# Altium project Doorbellv1.PrjPcb
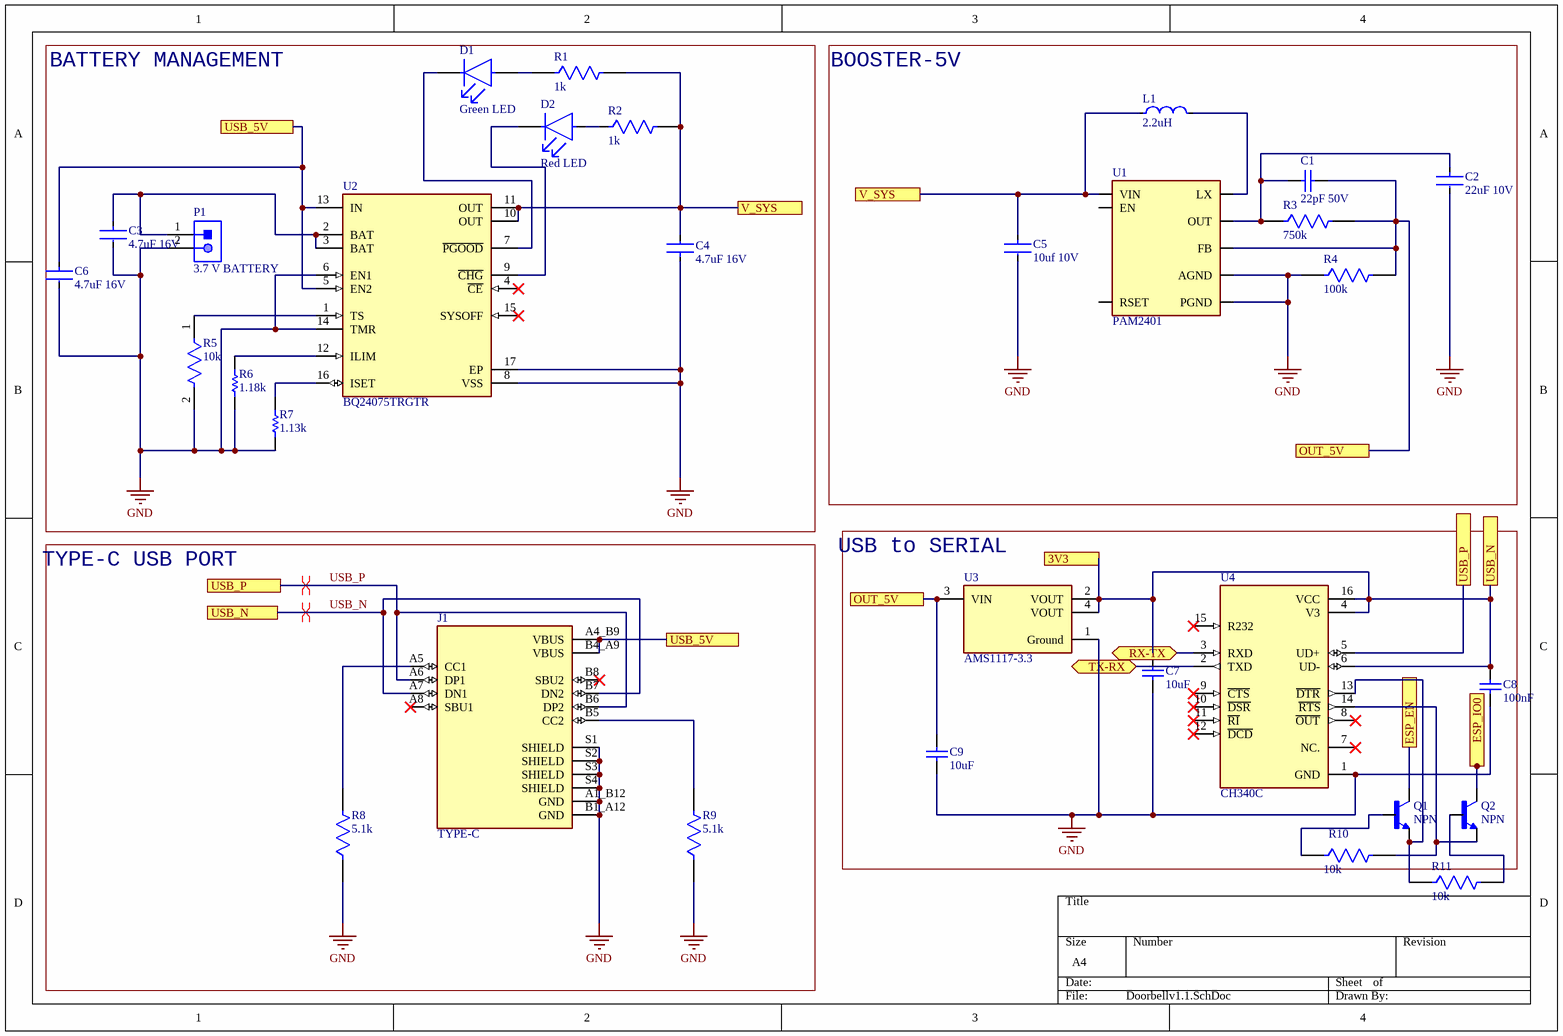
[diagram p0: Doorbellv1.1.SchDoc]
3 sheets, 49 parts. Net scope: flat (ports and power ports of the same name join across sheets).
Board file: MainBoard.PcbDoc
Sheets:
  Doorbellv1.1.SchDoc
  Doorbellv1.2.SchDoc
  Doorbellv1.3.SchDoc

## Sheet Doorbellv1.1.SchDoc
size A4; SheetNumber: 1; SheetTotal: 3

### Parts
C1  22pF 50V  [CAPC0805(2012)145_N]
C2  22uF 10V  [FP-C0805C226M8PACTU-MFG]
C3  4.7uF 16V  [FP-GRM21B-0_15-MFG]
C4  4.7uF 16V  [FP-GRM21B-0_15-MFG]
C5  10uf 10V  [FP-C0805X106K8RACAUTO-MFG]
C6  4.7uF 16V  [FP-GRM21B-0_15-MFG]
C7  10uF  [CAPC2013X140X50ML20T25]
C8  100nF  [CAPC1608X90X35NL15T15]
C9  10uF  [CAPC2013X140X50ML20T25]
D1  Green LED  [FP-APHCM2012CGCK-F01-MFG]
D2  Red LED  [FP-LS_R976-MFG]
J1  TYPE-C  [HRO_TYPE-C-31-M-12]
L1  2.2uH  [FP-NR4018-MFG]
P1  3.7 V BATTERY  [JST-S2B-PH-K-S_V]
Q1  NPN  [TRANS_SS8050-G]
Q2  NPN  [TRANS_SS8050-G]
R1  1k  [FP-TFCR0805-IPC_A]
R2  1k  [FP-TFCR0805-IPC_A]
R3  750k  [FP-AC0805-MFG]
R4  100k  [FP-CRCW0805-e3-IPC_A]
R5  10k  [FP-RN732B-MFG]
R6  1.18k  [RESC2013X60X35LL10T20]
R7  1.13k  [RESC0805(2012)_L]
R8  5.1k  [FP-CRCW0603-C-MFG]
R9  5.1k  [FP-CRCW0603-C-MFG]
R10  10k  [FP-CPF0603-MFG]
R11  10k  [FP-CPF0603-MFG]
U1  PAM2401  [MSOP8]
U2  BQ24075TRGTR  [FP-RGT0016C-IPC_C]
U3  AMS1117-3.3  [FP-AMS1117-IPC_C]
U4  CH340C  [SOIC127P600X180-16N]

### Blocks framed on the sheet
BATTERY MANAGEMENT: C3 C4 C6 D1 D2 P1 R1 R2 R5-R7 U2
BOOSTER-5V: C1 C2 C5 L1 R3 R4 U1
TYPE-C USB PORT: J1 R8 R9
USB to SERIAL: C7-C9 Q1 Q2 R10 U3 U4

### Ports
3V3 (see Doorbellv1.2[2A], Doorbellv1.3[1A]), ESP_EN (see Doorbellv1.2[1B]), ESP_IO0 (see Doorbellv1.2[1B]), OUT_5V (see Doorbellv1.1[3C], Doorbellv1.2[4B], Doorbellv1.3[1C], Doorbellv1.3[3B], Doorbellv1.3[4A]), OUT_5V (see Doorbellv1.1[4B], Doorbellv1.2[4B], Doorbellv1.3[1C], Doorbellv1.3[3B], Doorbellv1.3[4A]), RX-TX (bidir, see Doorbellv1.2[2B]), TX-RX (bidir, see Doorbellv1.2[2B]), USB_5V (see Doorbellv1.1[1A]), USB_5V (see Doorbellv1.1[2C]), USB_N (see Doorbellv1.1[1C]), USB_N (see Doorbellv1.1[4C]), USB_P (see Doorbellv1.1[1C]), USB_P (see Doorbellv1.1[4C]), V_SYS (see Doorbellv1.1[2A]), V_SYS (see Doorbellv1.1[3A])

### Nets
GND: C2.2 C3.2 C4.1 C5.2 C6.2 C7.1 C8.1 C9.1 J1.A1_B12(GND) J1.B1_A12(GND) J1.S1(SHIELD) J1.S2(SHIELD) J1.S3(SHIELD) J1.S4(SHIELD) P1.2 R4.1 R5.2 R6.1 R7.1 R8.1 R9.1 U1.4(AGND) U1.8(PGND) U2.6(EN1) U2.8(VSS) U2.14(TMR) U2.17(EP) U3.1(Ground) U4.1(GND)
CAM_XCLK: Q2.3(C) ; port ESP_IO0
USB_N: C7.2 C8.2 J1.A7(DN1) J1.B7(DN2) U3.2(VOUT) U3.4(VOUT) U4.4(V3) U4.6(UD-) U4.16(VCC) ; port USB_N, port 3V3
USB_P: J1.A6(DP1) J1.B6(DP2) U4.5(UD+) ; port USB_P
NetC1_1: C1.1 C2.1 R3.1 U1.7(OUT)
NetC1_2: C1.2 C9.2 R3.2 R4.2 U1.5(FB) U3.3(VIN) ; port OUT_5V
NetC3_1: C3.1 P1.1 U2.2(BAT) U2.3(BAT)
NetC4_2: C4.2 C5.1 L1.1 R1.2 R2.2 U1.3(VIN) U2.10(OUT) U2.11(OUT) ; port V_SYS
NetC6_1: C6.1 J1.A4_B9(VBUS) J1.B4_A9(VBUS) U2.5(EN2) U2.13(IN) ; port USB_5V
NetC11_1: Q1.3(C) ; port ESP_EN
NetD1_1: D1.1(C) U2.7(~{PGOOD})
NetD1_2: D1.2(A) R1.1
NetD2_1: D2.1(C) U2.9(~{CHG})
NetD2_2: D2.2(A) R2.1
NetJ1_A5: J1.A5(CC1) R8.2
NetJ1_B5: J1.B5(CC2) R9.2
NetL1_2: L1.2 U1.1(LX)
NetQ1_1: Q1.1(B) R10.1
NetQ1_2: Q1.2(E) R11.1 U4.13(~{DTR})
NetQ2_1: Q2.1(B) R11.2
NetQ2_2: Q2.2(E) R10.2 U4.14(~{RTS})
NetR5_1: R5.1 U2.1(TS)
NetR6_2: R6.2 U2.12(ILIM)
NetR7_2: R7.2 U2.16(ISET)
NetU4_2: U4.2(TXD) ; port TX-RX
NetU4_3: U4.3(RXD) ; port RX-TX

Not connected (* = marked no-connect by the designer): J1 A8(SBU1)* B8(SBU2)*; U1 2(EN) 6(RSET); U2 4(~{CE})* 15(SYSOFF)*; U4 7(NC.)* 8(~{OUT})* 9(~{CTS})* 10(~{DSR})* 11(~{RI})* 12(~{DCD})* 15(R232)*

### Layout directives
differential pair: USB_N, USB_P

### Library data of the parts
C1 = CMP-1036-01235-1: CAP 22pF 50V ±1% 0805 (2012 Metric) Thickness 1.45mm SMD; Tolerance: Â±1%; Case-Metric: 2012; Case-EIA: 0805; Max Thickness: 1.45 mm; Rated Voltage: 50 V; Value: 22pF; Technology: SMT
C2 = CMP-03020-034697-1: CAP CER 22UF 10V X5R 0805; Tolerance: 20%; Dissipation Factor: 10%; Dielectric Material: Ceramic; Termination: Solder; Case Code (Imperial): 0805; Packaging: Tape and Reel; Height: 1.25mm; Voltage: 10V; Case Code (Metric): 2012; Case/Package: 0805; Width: 0.049inch; Capacitance: 22uF; Length: 0.079inch; Depth: 1.25mm; RoHS Compliant: Yes; Voltage Rating (DC): 10V; Lead Free: Lead Free; Dielectric: X5R; Thickness: 0.055inch; Mount: Surface Mount; Voltage Rating: 10V; Max Operating Temperature: 85°C; Min Operating Temperature: -55°C
C3 C4 C6 = CMP-06035-032042-1: Chip Multilayer Ceramic Capacitors for General Purpose, 0805, 4.7uF, X7R, 15%, 20%, 16V; Tolerance: 20%; Capacitance: 4.7uF; Case/Package: 0805; Thickness: 1.25mm; Length: 2mm; Width: 1.25mm; Dielectric: X7R; Voltage Rating (DC): 16V
C5 = CMP-03020-034694-1: Tolerance: 10%; Case/Package: 0805; Min Operating Temperature: -55°C; Max Operating Temperature: 125°C; RoHS Compliant: Yes; Ratings: AEC-Q200; Mount: Surface Mount; Features: Soft Termination; Capacitance: 10uF; Packaging: Cut Tape; Case Code (Metric): 2012; Voltage Rating: 10V; Case Code (Imperial): 0805
C7 C9 = CMP-2007-04644-1: Part Number: 08056D106KAT4A; Manufacturer: AVX Interconnect / Elco
C8 = CMP-2006-04392-1: Manufacturer: AVX Interconnect / Elco; Part Number: 06035C104MAT2A
D1 = CMP-44529-000062-1: LED GREEN CLEAR CHIP SMD; Dominant Wavelength: 570nm; Forward Current: 20mA; Number of LEDs: 1; Luminous Intensity: 40mcd; Forward Voltage: 2.1V; Viewing Angle: 110°; Illumination Color: Green; Lens Style: Clear; Mount: Surface Mount; Length: 2mm; Max Operating Temperature: 85°C; Series: APHCM; Width: 1.25mm; Lead Free: Lead Free; Wavelength: 570nm; Package Quantity: 1; Number of Pins: 2; Case Code (Metric): 2012; RoHS Compliant: Yes; Packaging: Tape and Reel; Lens Color: Clear; Case/Package: 0805; Case Code (Imperial): 0805; Test Current: 20mA; Color: Green; Min Operating Temperature: -40°C; Height: 0.4mm
D2 = CMP-62016-000037-1: LED RED DIFFUSED 0805 SMD; Lens Size: 1.25mm; Number of LEDs: 1; Luminous Intensity: 180mcd; Dominant Wavelength: 633nm; Lens Style: Flat; Reverse Voltage: 12V; Lens Color: White; Forward Voltage: 2.5V; Forward Current: 25mA; Power Dissipation: 65W; Luminous Flux: 0.47lm; Test Current: 20mA; Viewing Angle: 160°; Length: 2mm; Number of Pins: 2; Lens Transparency: Diffused; Min Operating Temperature: -30°C; Case Code (Metric): 2012; Depth: 1.35mm; Color: Red; Illumination Color: Red; Max Operating Temperature: 85°C; Mount: Surface Mount; Case/Package: 0805; Height: 0.9mm; Package Quantity: 16000; Number of Elements: 1; Radiation Hardening: No; Case Code (Imperial): 0805; Packaging: Tape and Reel; Width: 1.25mm
J1 = TYPE-C-31-M-12: USB Connectors 24 Receptacle 1 8.94*7.3mm RoHS; MF: HRO Electronics Co., Ltd.; SnapEDA_Link: https://www.snapeda.com/parts/TYPE-C-31-M-12/HRO+Electronics+Co.%252C+Ltd./view-part/?ref=snap; Package: Package; Value: *; MP: TYPE-C-31-M-12; Check_prices: https://www.snapeda.com/parts/TYPE-C-31-M-12/HRO+Electronics+Co.%252C+Ltd./view-part/?ref=eda
L1 = CMP-14484-000071-2: SMD Power Inductors 2.2uH ±20% 2.2A 50.4mΩ; Test Frequency: 100kHz; Shielding: Shielded; Core Material: Ferrite; Saturation Current: 3A; Self Resonant Frequency: 60MHz; DC Resistance (DCR): 50.4mR; Height - Seated (Max): 0.071inch; RMS Current (Irms): 2.2A; Min Operating Temperature: -25°C; RoHS Compliant: Yes; Max Operating Temperature: 125°C; Package Quantity: 3500; Halogen Free: Halogen Free; Number of Pins: 2; Packaging: Tape and Reel; Inductance Tolerance: 20%; Lead Pitch: 2.8mm; Width: 0.157inch; Max DC Current: 3A; Tolerance: 20%; Length: 4mm; Resistor Type: Wirewound; Depth: 4.2mm; Current Rating: 2.2A; Lead Free: Lead Free; Series: NRS; Termination: SMD/SMT; Radiation Hardening: No; Mount: Surface Mount; Height: 1.8mm; Inductance: 2.2uH; Case/Package: Nonstandard
P1 = CMP-1755-00004-1: Male Header, Pitch 2 mm, 1 x 2 Position, Height 4.8 mm, Tail Length 3.4 mm, -25 to 85 degC, RoHS, Bulk; Case\Package: Radial; Tolerance: 20%; Capacitance: 10 uF; Voltage Rating (DC): 50 V; Packaging: Bulk; ComponentLink1URL: http://www.jst-mfg.com/product/pdf/eng/ePH.pdf; Radiation Hardening: No; Height: 11 mm; Package Quantity: 200; PackageDescription: Male Header, Pitch 2 mm, 1 x 2 Position, Height 4.8 mm, Tail Length 3.4 mm; PackageReference: S2B-PH-K-S; Diameter: 5 mm; Pins: 2; Mount: Through Hole; Max Operating Temperature: 85 degC; Min Operating Temperature: -40 degC; ComponentLink1Description: Datasheet; DatasheetVersion: Dec-12; Length: 11 mm; Lead Pitch: 2 mm; REACH SVHC: No SVHC; Voltage Rating: 50 V; RoHSCompliant: true
Q1 Q2 = SS8050-G: Bipolar (BJT) Transistor NPN 25 V 1.5 A 100MHz 300 mW Surface Mount SOT-23-3; MP: SS8050G; MF: Comchip; Digi-Key_Part_Number: 641-1790-2-ND; Check_prices: https://www.snapeda.com/parts/SS8050G/Comchip/view-part/?ref=eda; Package: None; SnapEDA_Link: https://www.snapeda.com/parts/SS8050G/Comchip/view-part/?ref=snap; Value: *
R1 R2 = CMP-250906-148809-1: RES Thin Film,  1kΩ, 0.1%, 0.1W, 25ppm/°C, 0805
R3 = CMP-03412-037118-1: AC Series 0805 750 kO ±1% 0.125 W ±100 ppm/°C SMT Thick Film Chip Resistor; Manufacturer: Yageo; Manufacturer Part Number: AC0805FR-07750KL; Resistance: 750KΩ; Power Rating: 1/8W; Automotive Grade: Grade 0; Value: 750KΩ; Tolerance: 0.01; Voltage Rating: 150V; Device Class L1: Passive Components; Ipc Land Pattern Name: RESC200125X50; Temperature: -55°C to +155°C; Device Class L2: Resistors; RoHS: TRUE; Composition: Thick Film; Device Class L3: Chip SMD Resistors; ComponentLink2URL: http://www.yageo.com/documents/recent/PYu-AC_51_RoHS_L_6.pdf; Footprint Url: http://www.yageo.com/exep/pages/download/literatures/PYu-R_Mount_10.pdf; Temperature Range High: +155°C; Automotive: Yes; Digikey Description: AC Series 0805 750 kO ±1% 0.125 W ±100 ppm/°C SMT Thick Film Chip Resistor; ComponentLink2Description: Datasheet; Package: AC0805; Temperature Range Low: -55°C; Lead Free: Yes; Octopart: https://octopart.com/ac0805fr-07750kl-yageo-26041180; Category: Res; Height: 0.6mm; Series: AC
R4 = CMP-02407-006346-1: RES Thick Film, 100kΩ, 1%, 0.125W, 100ppm/°C, 0805; Resistance: 100kR; Max Power Dissipation: 125mW; Max Operating Temperature: 155°C; Lead Free: Lead Free; Temperature Coefficient: 100ppm/°C; Radiation Hardening: No; Military Standard: Not; Height: 0.02inch; Contact Plating: Tin; Length: 0.079inch; Tolerance: 1%; Composition: Thick Film; Case/Package: 0805; Package Quantity: 20000; Width: 0.049inch; Depth: 1.25mm; Features: Automotive AEC-Q200; Number of Terminations: 2; Packaging: Tape and Reel; Min Operating Temperature: -55°C
R5 = CMP-04015-036251-1: 10kΩ ±0.1% 0.125W, 1/8W Chip Resistor 1206 (3216 Metric) Moisture Resistant Thin Film; Voltage Rating: 150V; Power Rating: 125mW; Temperature Coefficient: 10ppm/°C; Resistance: 10kR; Case Code (Imperial): 1206; Weight: 0.000571oz; Composition: Thin Film; Max Operating Temperature: 125°C; Width: 1.6mm; Termination: SMD/SMT; Case/Package: 1206; Voltage Rating (DC): 150V; Tolerance: 0.1%; Min Operating Temperature: -55°C; Packaging: Tape and Reel; Case Code (Metric): 3216; Length: 3.2mm; Height: 0.6mm
R6 = CMP-2001-00901-1: Manufacturer: Yageo; Part Number: RC0805FR-07118KL
R7 = CMP-1013-00515-1: 1K13 0.125W 1% 0805 (2012 Metric)  SMD; Value: 1130.00 Ohm; Case-Metric: 2012; Case-EIA: 0805; Tolerance: 1 %; Technology: SMT; Power: 0.125 W
R8 R9 = CMP-02407-012725-1: RES 5.1K OHM 1% 1/10W 0603; Max Power Dissipation: 100mW; Resistance: 5.1kR; Temperature Coefficient: 100ppm/°C; Min Operating Temperature: -55°C; Packaging: Tape and Reel; Max Operating Temperature: 155°C; RoHS Compliant: Yes; Series: CRCW-C; Case/Package: 0603; Number of Terminations: 2; Tolerance: 1%; Resistor Type: Thick Film
R10 R11 = CMP-03211-003506-1: RES SMD 10KΩ 0.5% 1/16W 0603; Manufacturer: TE Connectivity; Manufacturer Part Number: CPF0603D10KE; Power Rating: 0.063W; Temperature Coefficient: 25ppm/°C; Voltage Rating: 50V; ComponentLink2Description: Datasheet; packaging: 5k Reel; Automotive: No; Octopart: https://octopart.com/cpf0603d10ke-te+connectivity-22737789; Composition: Thin Film; Value: 10KΩ; Category: Res; RoHS: TRUE; Height: 0.55mm; Lead Free: Yes; ComponentLink2URL: https://www.te.com/commerce/DocumentDelivery/DDEController?Action=showdoc&DocId=Data+Sheet%7F1773200%7FM%7Fpdf%7FEnglish%7FENG_DS_1773200_M.pdf%7F3-1676481-2; Temperature: -55°C to +155°C; Device Class L3: Chip SMD Resistors; Device Class L1: Passive Components; octopart_url: https://octopart.com/cpf0603d10ke-te+connectivity-22737789; Tolerance: 0.5%; Resistance: 10KΩ; Package: CPF0603; Temperature Range High: +155°C; Series: CPF; Temperature Range Low: -55°C; Device Class L2: Resistors; Ipc Land Pattern Name: RESC15580X45
U1 = PAM2401: Conv DC-DC 0.9V to 4.75V Synchronous Step Up Single-Out 2.5V to 5V 12-Pin UDFN EP T/R; MF: Diodes Zetex; SnapEDA_Link: https://www.snapeda.com/parts/PAM2401/Zetex/view-part/?ref=snap; Package: None; Value: *; MP: PAM2401; Check_prices: https://www.snapeda.com/parts/PAM2401/Zetex/view-part/?ref=eda
U2 = CMP-0321-00266-3: IC LI-ION CHARGE/PWR MGMT 16QFN; Min Supply Voltage: 4.35V; Max Power Dissipation: 2.3W; Min Input Voltage: 4.3V; Output Current: 1.5A; Number of Cells: 1; Operating Supply Current: 1.5mA; Output Voltage: 4.2V; Max Supply Voltage: 6.4V; RoHS Compliant: Yes; Case/Package: VQFN EP; Contact Plating: Gold; Min Operating Temperature: -40°C; Lead Free: Lead Free; Series: -; Number of Pins: 16; Radiation Hardening: No; Package Quantity: 1; Max Operating Temperature: 85°C; Packaging: Tape and Reel
U3 = CMP-209535-000001-1: LDO Voltage Regulators 1A, 3.3V; Manufacturer: Advanced Monolithic Systems; Dropout Voltage: 1.1V; Output Type: Fixed; Nominal Supply Current: 5mA; Max Power Dissipation: 1.2W; Max Supply Voltage: 15V; Number Of Outputs: 1; Standoff Height: 0.64mm; Max Junction Temp: +125°C; Height: 1.8mm; Package: AMS1117; Device Class L2: Power Management ICs; ComponentLink2Description: Datasheet; ComponentLink2URL: http://www.advanced-monolithic.com/pdf/ds1117.pdf; Category: IC; RoHS: TRUE; Automotive: No; Device Class L1: Integrated Circuits (ICs); Output Current: 1A; Device Class L3: Voltage Regulators - Linear; Temperature: -40°C to +125°C; Output Voltage: 3.3V; Manufacturer Part Number: AMS1117-3.3; Temperature Range Low: -40°C; Octopart: https://octopart.com/ams1117-3.3-advanced+monolithic+systems-25899300; Lead Free: Yes; Ipc Land Pattern Name: SOT229P700X180-4; Temperature Range High: +125°C
U4 = CH340C: USB to serial chip CH340; MF: WCH; Price: None; Availability: Not in stock; MP: CH340C; Package: None; SnapEDA_Link: https://www.snapeda.com/parts/CH340C/WCH/view-part/?ref=snap; Check_prices: https://www.snapeda.com/parts/CH340C/WCH/view-part/?ref=eda; Value: *

## Sheet Doorbellv1.2.SchDoc
size A4; SheetNumber: 2; SheetTotal: 3
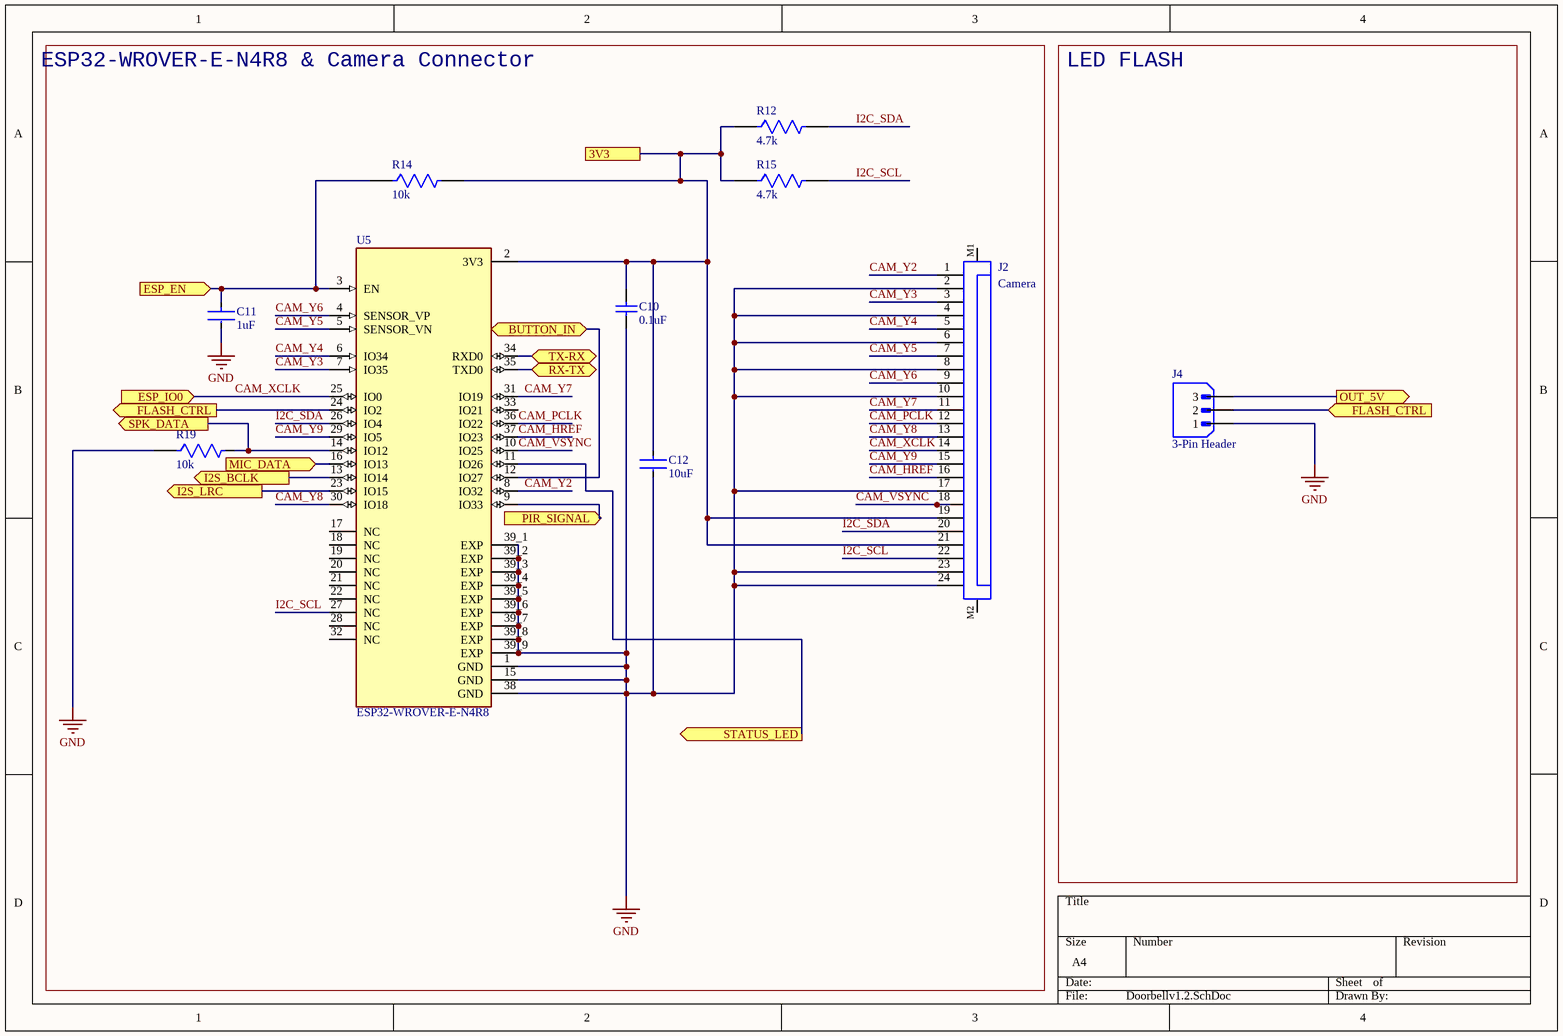
[diagram p1: Doorbellv1.2.SchDoc]

### Parts
C10  0.1uF  [CAPC1608X90X35NL15T15]
C11  1uF  [FP-CC0603-DA-MFG]
C12  10uF  [FP-C0603C106M8PACTU-MFG]
J2  Camera  [68712414522]
J4  3-Pin Header  [JST_B3B-XH-A]
R12  4.7k  [FP-TFCR0603-IPC_B]
R14  10k  [FP-MCT0603-IPC_B]
R15  4.7k  [FP-TFCR0603-IPC_B]
R19  10k  [FP-MCT0603-IPC_B]
U5  ESP32-WROVER-E-N4R8  [XCVR_ESP32-WROVER-E-N4R8]

### Blocks framed on the sheet
ESP32-WROVER-E-N4R8 & Camera Connector: C10-C12 J2 R12 R14 R15 R19 U5
LED FLASH: J4

### Ports
3V3 (see Doorbellv1.1[3C], Doorbellv1.3[1A]), BUTTON_IN (bidir, see Doorbellv1.3[3C]), ESP_EN (in, see Doorbellv1.1[4C]), ESP_IO0 (in, see Doorbellv1.1[4C]), FLASH_CTRL (in, see Doorbellv1.2[1B]), FLASH_CTRL (out, see Doorbellv1.2[4B]), I2S_BCLK (out, see Doorbellv1.3[2B], Doorbellv1.3[3A]), I2S_LRC (out, see Doorbellv1.3[2B], Doorbellv1.3[3A]), MIC_DATA (in, see Doorbellv1.3[2B]), OUT_5V (out, see Doorbellv1.1[3C], Doorbellv1.1[4B], Doorbellv1.3[1C], Doorbellv1.3[3B], Doorbellv1.3[4A]), PIR_SIGNAL (in, see Doorbellv1.3[1C]), RX-TX (bidir, see Doorbellv1.1[3C]), SPK_DATA (out, see Doorbellv1.3[3A]), STATUS_LED (out, see Doorbellv1.3[2C]), TX-RX (bidir, see Doorbellv1.1[3C])

### Nets
GND: C10.2 C11.2 C12.2 J2.2 J2.4 J2.6 J2.8 J2.10 J2.17 J2.23 J2.24 J4.1 R19.1 U5.1(GND) U5.15(GND) U5.38(GND) U5.39_1(EXP) U5.39_2(EXP) U5.39_3(EXP) U5.39_4(EXP) U5.39_5(EXP) U5.39_6(EXP) U5.39_7(EXP) U5.39_8(EXP) U5.39_9(EXP)
CAM_HREF: J2.16 U5.37(IO23)
CAM_PCLK: J2.12 U5.36(IO22)
CAM_VSYNC: J2.18 U5.10(IO25)
CAM_XCLK: J2.14 U5.25(IO0) ; port ESP_IO0
CAM_Y2: J2.1 U5.8(IO32)
CAM_Y3: J2.3 U5.7(IO35)
CAM_Y4: J2.5 U5.6(IO34)
CAM_Y5: J2.7 U5.5(SENSOR_VN)
CAM_Y6: J2.9 U5.4(SENSOR_VP)
CAM_Y7: J2.11 U5.31(IO19)
CAM_Y8: J2.13 U5.30(IO18)
CAM_Y9: J2.15 U5.29(IO5)
I2C_SCL: J2.22 R15.2 U5.27(NC)
I2C_SDA: J2.20 R12.2 U5.26(IO4)
USB_N: C10.1 C12.1 J2.19 J2.21 R12.1 R14.2 R15.1 U5.2(3V3) ; port 3V3
NetC1_2: J4.3 ; port OUT_5V
NetC11_1: C11.1 R14.1 U5.3(EN) ; port ESP_EN
NetJ4_2: J4.2 U5.24(IO2) ; port FLASH_CTRL
NetM1_1: U5.13(IO14) ; port I2S_BCLK
NetM1_2: U5.16(IO13) ; port MIC_DATA
NetM1_3: U5.23(IO15) ; port I2S_LRC
NetP3_2: U5.9(IO33) ; port PIR_SIGNAL
NetR19_2: R19.2 U5.14(IO12) ; port SPK_DATA
NetR22_1: U5.11(IO26) ; port STATUS_LED
NetSW1_1: U5.12(IO27) ; port BUTTON_IN
NetU4_2: U5.34(RXD0) ; port TX-RX
NetU4_3: U5.35(TXD0) ; port RX-TX

Not connected (* = marked no-connect by the designer): J2 M1 M2; U5 17(NC) 18(NC) 19(NC) 20(NC) 21(NC) 22(NC) 28(NC) 32(NC) 33(IO21)

### Library data of the parts
C10 = CMP-2006-02299-1: Part Number: C0603C104K4RAC7013; Manufacturer: Kemet
C11 = CMP-03422-000857-1: CAP CER 1UF 25V X5R 0603; Manufacturer: YAGEO; Manufacturer Part Number: CC0603MRX5R8BB105; Tolerance: 0.2; Material: Ceramic; Temperature Coefficient: 15%; Octopart: https://octopart.com/cc0603mrx5r8bb105-yageo-57080766; Temperature Characteristic: X5R; Device Class L3: Ceramic Capacitors; Device Class L2: Capacitors; Device Class L1: Passive Components; Voltage: 25 V; ComponentLink2URL: http://www.yageo.com/documents/recent/UPY-GPHC_X7R_6.3V-to-50V_18.pdf; Temperature Range High: +125°C; Height: 0.9mm; Digikey Description: CAP CER 1UF 25V X5R 0603; Category: Cap; Temperature Range Low: -55°C; Footprint Url: http://www.yageo.com/exep/pages/download/literatures/UPY-C_GEN_24.pdf; Automotive: No; Package: CC0603-DA; Lead Free: Yes; ComponentLink2Description: Datasheet; Value: 1 uF; RoHS: TRUE; Voltage Rating: 25 V; Capacitance: 1 uF; Temperature: -55°C to +125°C
C12 = CMP-03020-034654-1: CAP CER 10UF 10V X5R 0603; RoHS Compliant: Yes
J2 = CMP-1502-01537-3: Ffc/fpc Conn, R/a Rcpt, 24POS, 1ROW, SMT Rohs Compliant: Yes; Operating Supply Voltage: 50V; Pitch: 500µm; Number of Positions: 24; Insulation Resistance: 100MΩ; Contact Location: Top; Contact Resistance: 20mΩ; Gender: Receptacle; Current Rating: 500mA; Actuator Material: Liquid Crystal Polymer, Polymer; Number of Pins: 24; RoHS: Compliant; Length: 12.6mm; Number of Rows: 1; Mount: Surface Mount; Contact Plating: Tin; Flammability Rating: UL94 V-0; REACH SVHC: Unknown; Voltage Rating: 50V; Lead Pitch: 500µm; Number of Contacts: 24; Packaging: Tape and Reel; Max Operating Temperature: 85°C; Width: 2.1mm; Contact Material: Bronze, Tin; Housing Material: Liquid Crystal Polymer; Min Operating Temperature: -25°C; Termination: SMD/SMT; Orientation: Horizontal
J4 = B3B-XH-A: Connector Header Through Hole 3 position 0.098 (2.50mm); MF: JST Sales; SnapEDA_Link: https://www.snapeda.com/parts/B3B-XH-A/JST+Sales+America+Inc./view-part/?ref=snap; Package: None; Value: *; MP: B3B-XH-A; Check_prices: https://www.snapeda.com/parts/B3B-XH-A/JST+Sales+America+Inc./view-part/?ref=eda
R12 R15 = CMP-250906-287647-1: RES Thin Film,  4.7kΩ, 1%, 0.1W, 50ppm/°C, 0603
R14 R19 = CMP-02407-001090-1: RES SMD 100 OHM 1% 1/8W 0603
U5 = ESP32-WROVER-E-N4R8: Bluetooth, WiFi 802.11b/g/n, Bluetooth v4.2 +EDR Transceiver Module 2.4GHz ~ 2.5GHz PCB Trace Surface Mount; MF: Espressif Systems; SnapEDA_Link: https://www.snapeda.com/parts/ESP32-WROVER-E-N4R8/Espressif+Systems/view-part/?ref=snap; Package: SMD-38 Espressif Systems; Value: *; MP: ESP32-WROVER-E-N4R8; Check_prices: https://www.snapeda.com/parts/ESP32-WROVER-E-N4R8/Espressif+Systems/view-part/?ref=eda

## Sheet Doorbellv1.3.SchDoc
size A4; SheetNumber: 3; SheetTotal: 3
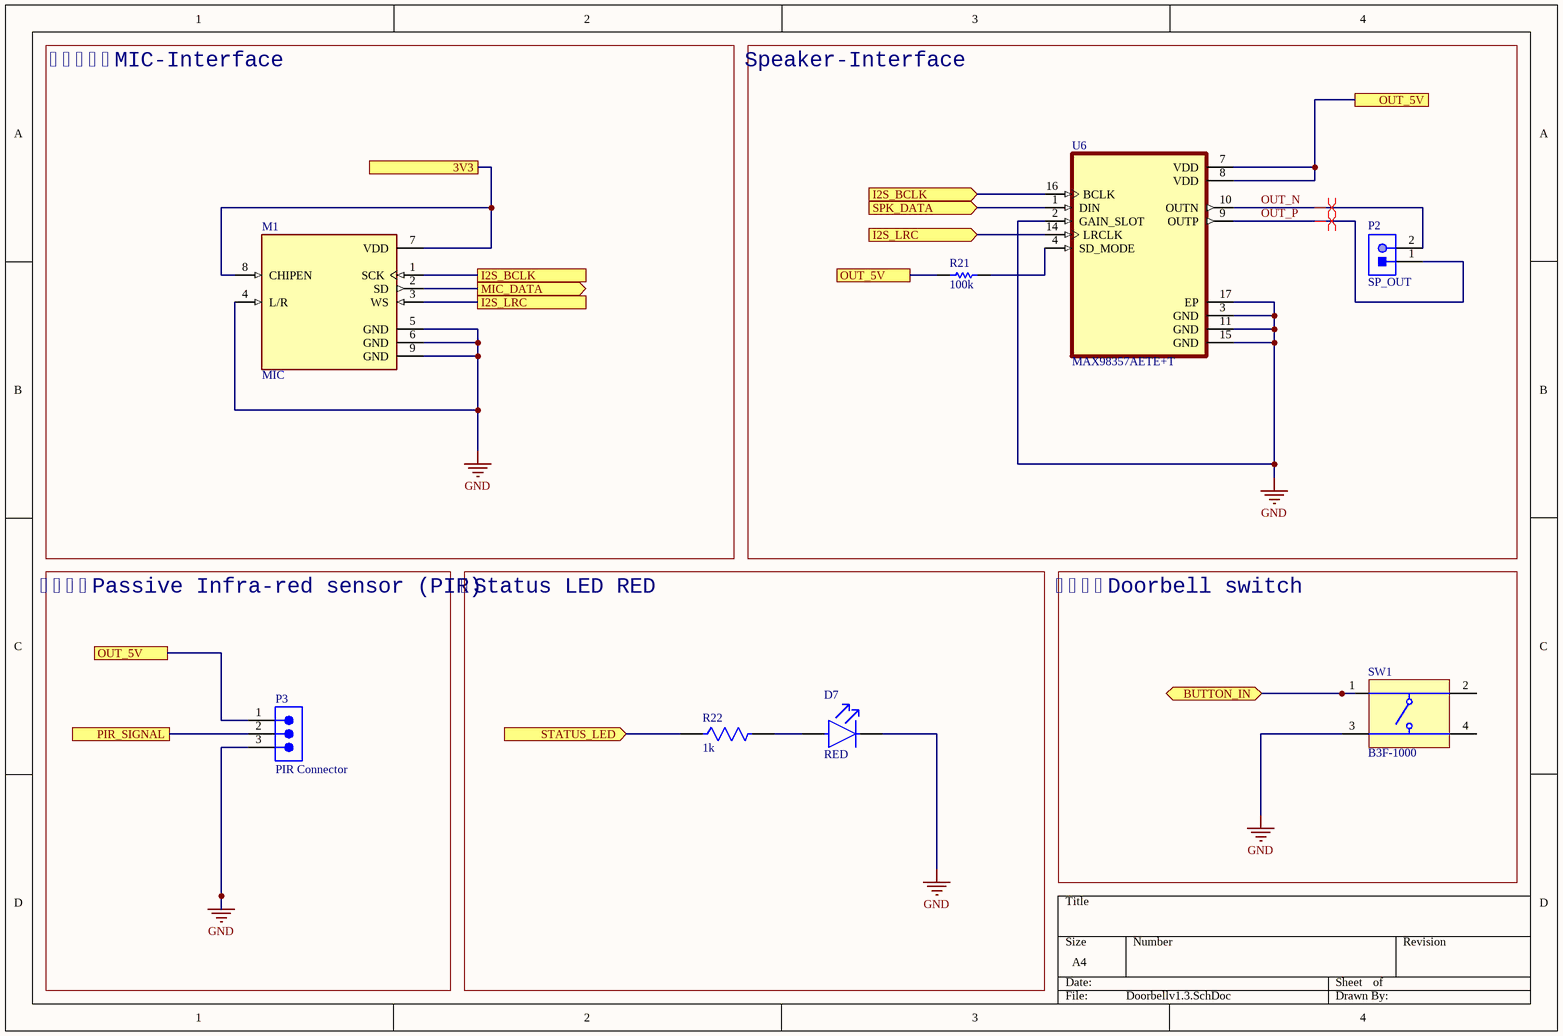
[diagram p2: Doorbellv1.3.SchDoc]

### Parts
D7  RED  [FP-LS_R976-MFG]
M1  MIC  [MIC_INMP441ACEZ-R7]
P2  SP_OUT  [JST-S2B-PH-K-S_V]
P3  PIR Connector  [61300311121]
R21  100k  [RESC0603(1608)_N]
R22  1k  [FP-MCU0805-IPC_A]
SW1  B3F-1000  [OMRON-B3F-1000-4_V]
U6  MAX98357AETE+T  [QFN50P300X300X80-17N]

### Blocks framed on the sheet
MIC-Interface: M1
Speaker-Interface: P2 R21 U6
Passive Infra-red sensor (PIR): P3
Status LED RED: D7 R22
Doorbell switch: SW1

### Ports
3V3 (see Doorbellv1.1[3C], Doorbellv1.2[2A]), BUTTON_IN (bidir, see Doorbellv1.2[2B]), I2S_BCLK (in, see Doorbellv1.2[1B], Doorbellv1.3[2B]), I2S_BCLK (see Doorbellv1.2[1B], Doorbellv1.3[3A]), I2S_LRC (in, see Doorbellv1.2[1B], Doorbellv1.3[2B]), I2S_LRC (see Doorbellv1.2[1B], Doorbellv1.3[3A]), MIC_DATA (out, see Doorbellv1.2[1B]), OUT_5V (see Doorbellv1.1[3C], Doorbellv1.1[4B], Doorbellv1.2[4B], Doorbellv1.3[1C], Doorbellv1.3[3B]), OUT_5V (see Doorbellv1.1[3C], Doorbellv1.1[4B], Doorbellv1.2[4B], Doorbellv1.3[1C], Doorbellv1.3[4A]), OUT_5V (see Doorbellv1.1[3C], Doorbellv1.1[4B], Doorbellv1.2[4B], Doorbellv1.3[3B], Doorbellv1.3[4A]), PIR_SIGNAL (see Doorbellv1.2[2C]), SPK_DATA (in, see Doorbellv1.2[1B]), STATUS_LED (in, see Doorbellv1.2[2C])

### Nets
GND: D7.1(C) M1.4(L/R) M1.5(GND) M1.6(GND) M1.9(GND) P3.3 SW1.3 U6.2(GAIN_SLOT) U6.3(GND) U6.11(GND) U6.15(GND) U6.17(EP)
OUT_N: P2.2 U6.10(OUTN)
OUT_P: P2.1 U6.9(OUTP)
USB_N: M1.7(VDD) M1.8(CHIPEN) ; port 3V3
NetC1_2: P3.1 R21.2 U6.7(VDD) U6.8(VDD) ; port OUT_5V
NetD7_2: D7.2(A) R22.2
NetM1_1: M1.1(SCK) U6.16(BCLK) ; port I2S_BCLK
NetM1_2: M1.2(SD) ; port MIC_DATA
NetM1_3: M1.3(WS) U6.14(LRCLK) ; port I2S_LRC
NetP3_2: P3.2 ; port PIR_SIGNAL
NetR19_2: U6.1(DIN) ; port SPK_DATA
NetR21_1: R21.1 U6.4(SD_MODE)
NetR22_1: R22.1 ; port STATUS_LED
NetSW1_1: SW1.1 ; port BUTTON_IN

Not connected (* = marked no-connect by the designer): SW1 2 4

### Layout directives
differential pair: OUT_N, OUT_P

### Library data of the parts
D7 = CMP-62016-000037-1: as D2 on sheet Doorbellv1.1; Length: 2mm; Number of Pins: 2; Lens Transparency: Diffused; Min Operating Temperature: -30°C; Case Code (Metric): 2012; Depth: 1.35mm; Color: Red; Illumination Color: Red; Max Operating Temperature: 85°C; Mount: Surface Mount; Case/Package: 0805; Height: 0.9mm; Package Quantity: 16000; Number of Elements: 1; Radiation Hardening: No; Case Code (Imperial): 0805; Packaging: Tape and Reel; Width: 1.25mm
M1 = INMP441ACEZ-R7: 60 Hz ~ 15 kHz Digital, I2S Microphone MEMS (Silicon) 1.62 V ~ 3.63 V Omnidirectional (-26dB Â±3dB @ 94dB SPL) Solder Pads; MF: TDK InvenSense; SnapEDA_Link: https://www.snapeda.com/parts/INMP441ACEZ-R7/TDK/view-part/?ref=snap; Package: LGA-9 TDK InvenSense; Value: *; MP: INMP441ACEZ-R7; Check_prices: https://www.snapeda.com/parts/INMP441ACEZ-R7/TDK/view-part/?ref=eda
P2 = CMP-1755-00004-1: as P1 on sheet Doorbellv1.1; Packaging: Bulk; ComponentLink1URL: http://www.jst-mfg.com/product/pdf/eng/ePH.pdf; Radiation Hardening: No; Height: 11 mm; Package Quantity: 200; PackageDescription: Male Header, Pitch 2 mm, 1 x 2 Position, Height 4.8 mm, Tail Length 3.4 mm; PackageReference: S2B-PH-K-S; Diameter: 5 mm; Pins: 2; Mount: Through Hole; Max Operating Temperature: 85 degC; Min Operating Temperature: -40 degC; ComponentLink1Description: Datasheet; DatasheetVersion: Dec-12; Length: 11 mm; Lead Pitch: 2 mm; REACH SVHC: No SVHC; Voltage Rating: 50 V; RoHSCompliant: true
P3 = CMP-1502-01062-4: THT Vertical Pin Header WR-PHD, Pitch 2.54 mm, Single Row, 3 pins; Connector Type: Male Pin; Number of Contacts: 3; Operating Supply Voltage: 250V; Current Rating: 3A; Pitch: 2.54mm; Contact Resistance: 20mΩ; Gender: Male; Height: 8.94mm; Color: Black; Min Operating Temperature: -40°C; Max Operating Temperature: 105°C; Mount: Through Hole; Termination: Solder; Number of Rows: 1; Packaging: Bulk; Number of Pins: 3; Lead Pitch: 2.54mm; RoHS: Compliant; Contact Plating: Gold; Number of Positions: 3; Lead Free: Lead Free; Voltage Rating: 250V; Contact Mating Length: 5.9944mm; Orientation: Vertical; Contact Material: Gold
R21 = CMP-1012-00736-1: 100K 0.1W 1% 0603 (1608 Metric)  SMD; Value: 100000.00 Ohm; Case-Metric: 1608; Case-EIA: 0603; Power: 0.1 W; Tolerance: 1 %; Technology: SMT
R22 = CMP-02407-000288-1: RES 1.05K OHM 0.5% 1/5W 0805; Tolerance: 0.1%; Resistance: 1kR; Power Rating: 200mW; Voltage Rating: 150V; Max Operating Temperature: 155°C; Width: 1.25mm; Min Operating Temperature: -55°C; Case Code (Metric): 2012; Packaging: Tape and Reel; Case Code (Imperial): 0805; Length: 2mm; Height: 0.52mm; Case/Package: 0805; Weight: 0.000162oz; Composition: Thin Film
SW1 = CMP-1677-00002-1: Tactile Switch, SPST-NO, 0.05 A, 5 to 24 V, -25 to 70 degC, 4-Pin THD, RoHS, Bulk; Shielding: Shielded; Gender: Female; Capacitance: -45 f; Voltage Rating: 150 V; Current Rating: 1.5 A; Radiation Hardening: No; Contact Plating: Gold; Height: 14.99 mm; Min Operating Temperature: -40 degC; Packaging: Tray; ComponentLink2Description: Datasheet; ComponentLink1URL: http://www.omron.com/; Lead Pitch: 1.27 mm; RoHSCompliant: true; Pins: 8; PackageReference: B3F-1000; Width: 25.4 mm; Contact Material: Brass; ComponentLink2URL: http://www.omron.com/ecb/products/pdf/en-b3f.pdf; PackageDescription: 4-Pin Through Hole Device, Body 6 x 6 mm; DatasheetVersion: Jan-15; ComponentLink1Description: Manufacturer URL; Package Quantity: 1080; Mount: Through Hole; Length: 18.34 mm; Max Operating Temperature: 70 degC
U6 = MAX98357AETE+T: Tiny, Low-Cost, PCM Class D Amplifier with Class AB Performance; MF: Analog Devices; SnapEDA_Link: https://www.snapeda.com/parts/MAX98357AETE+T/Analog+Devices/view-part/?ref=snap; Package: TQFN-16 Maxim; Value: *; MP: MAX98357AETE+T; Check_prices: https://www.snapeda.com/parts/MAX98357AETE+T/Analog+Devices/view-part/?ref=eda

## Nets that join several sheets
GND: Doorbellv1.1 (29 pins), Doorbellv1.2 (25 pins), Doorbellv1.3 (12 pins)
CAM_XCLK: Doorbellv1.1 (Q2.3), Doorbellv1.2 (J2.14 U5.25)
NetC1_2: Doorbellv1.1 (6 pins), Doorbellv1.2 (J4.3), Doorbellv1.3 (P3.1 R21.2 U6.7 U6.8)
NetC11_1: Doorbellv1.1 (Q1.3), Doorbellv1.2 (C11.1 R14.1 U5.3)
NetM1_1: Doorbellv1.2 (U5.13), Doorbellv1.3 (M1.1 U6.16)
NetM1_2: Doorbellv1.2 (U5.16), Doorbellv1.3 (M1.2)
NetM1_3: Doorbellv1.2 (U5.23), Doorbellv1.3 (M1.3 U6.14)
NetP3_2: Doorbellv1.2 (U5.9), Doorbellv1.3 (P3.2)
NetR19_2: Doorbellv1.2 (R19.2 U5.14), Doorbellv1.3 (U6.1)
NetR22_1: Doorbellv1.2 (U5.11), Doorbellv1.3 (R22.1)
NetSW1_1: Doorbellv1.2 (U5.12), Doorbellv1.3 (SW1.1)
NetU4_2: Doorbellv1.1 (U4.2), Doorbellv1.2 (U5.34)
NetU4_3: Doorbellv1.1 (U4.3), Doorbellv1.2 (U5.35)
USB_N: Doorbellv1.1 (9 pins), Doorbellv1.2 (8 pins), Doorbellv1.3 (M1.7 M1.8)